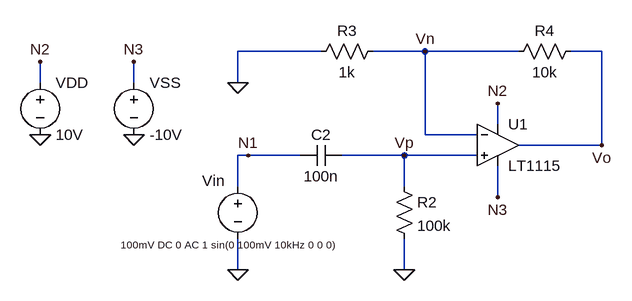
[diagram p0: schematic esercizio1.asc]
esercizio1.asc, the LTspice schematic file:
Version 4
SHEET 1 916 680
WIRE 64 -64 -64 -64
WIRE 224 -64 144 -64
WIRE 368 -64 224 -64
WIRE 496 -64 448 -64
WIRE -368 -16 -368 -48
WIRE -224 -16 -224 -48
WIRE -64 -16 -64 -64
WIRE 336 48 336 16
WIRE 224 64 224 -64
WIRE 304 64 224 64
WIRE 496 80 496 -64
WIRE 496 80 368 80
WIRE -48 96 -64 96
WIRE 32 96 -48 96
WIRE 192 96 96 96
WIRE 304 96 192 96
WIRE -64 144 -64 96
WIRE 192 144 192 96
WIRE 336 160 336 112
WIRE -64 272 -64 224
WIRE 192 272 192 224
FLAG -368 64 0
FLAG -224 64 0
FLAG 192 272 0
FLAG 224 -64 Vn
FLAG 496 80 Vo
FLAG -48 96 N1
FLAG -368 -48 N2
FLAG -224 -48 N3
FLAG 336 16 N2
FLAG 336 160 N3
FLAG 192 96 Vp
FLAG -64 -16 0
FLAG -64 272 0
SYMBOL voltage -64 128 R0
WINDOW 0 -55 7 Left 2
WINDOW 3 -180 105 Left 1
SYMATTR InstName Vin
SYMATTR Value 100mV DC 0 AC 1 sin(0 100mV 10kHz 0 0 0)
SYMBOL voltage -368 -32 R0
WINDOW 123 0 0 Left 0
WINDOW 39 0 0 Left 0
SYMATTR InstName VDD
SYMATTR Value 10V
SYMBOL voltage -224 -32 R0
WINDOW 123 0 0 Left 0
WINDOW 39 0 0 Left 0
SYMATTR InstName VSS
SYMATTR Value -10V
SYMBOL OpAmps\\LT1115 336 16 R0
SYMATTR InstName U1
SYMBOL cap 96 80 R90
WINDOW 0 0 32 VBottom 2
WINDOW 3 32 32 VTop 2
SYMATTR InstName C2
SYMATTR Value 100n
SYMBOL res 176 128 R0
SYMATTR InstName R2
SYMATTR Value 100k
SYMBOL res 352 -48 R270
WINDOW 0 32 56 VTop 2
WINDOW 3 0 56 VBottom 2
SYMATTR InstName R4
SYMATTR Value 10k
SYMBOL res 160 -80 R90
WINDOW 0 0 56 VBottom 2
WINDOW 3 32 56 VTop 2
SYMATTR InstName R3
SYMATTR Value 1k

The netlist it stands for:
* esercizio1.asc
Vin N1 0 100mV DC 0 AC 1 sin(0 100mV 10kHz 0 0 0)
VDD N2 0 10V
VSS N3 0 -10V
XU1 Vp Vn N2 N3 Vo LT1028  ; LT1115, pins In+ In- V+ V- OUT
C2 Vp N1 100n
R2 Vp 0 100k
R4 Vn Vo 10k
R3 Vn 0 1k
.lib LTC.lib
.backanno
.end